# EAGLE design alimentadorV6 (EAGLE 6.6.0)
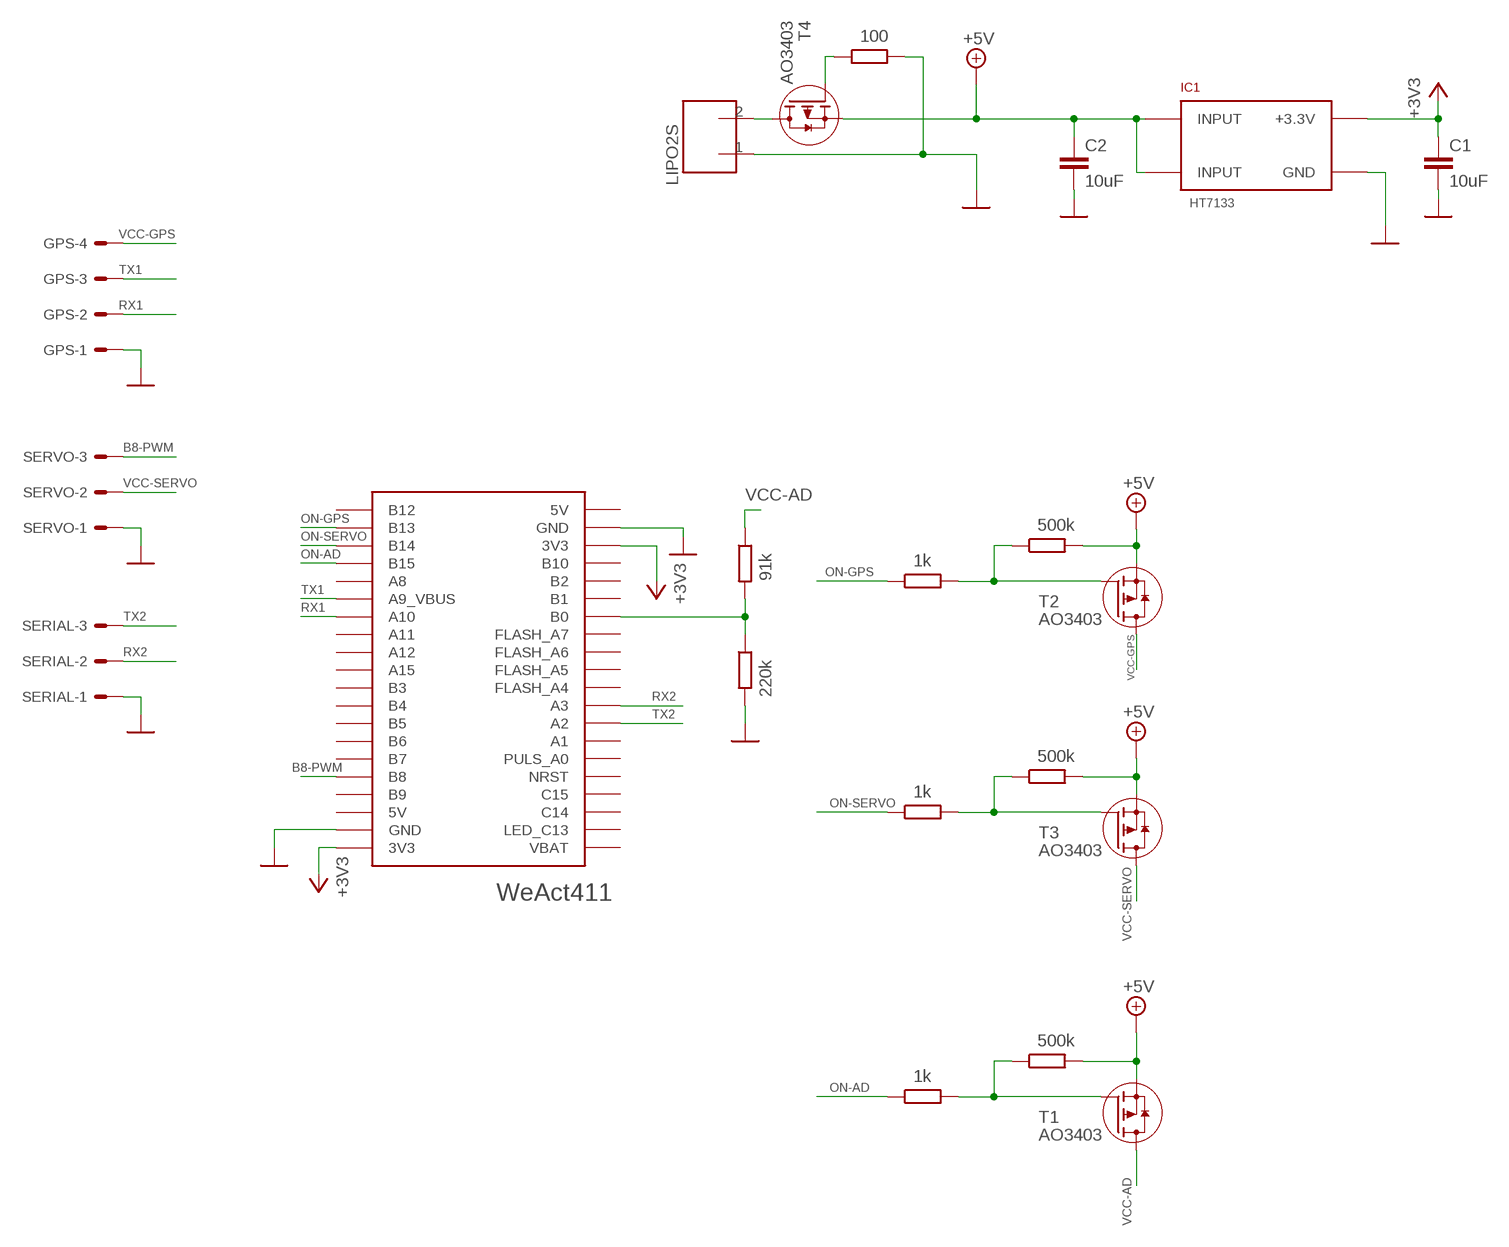
[diagram p0: schematic, sheet 1]

## Parts
C1  10uF  C-EUC1206  [C1206]
C2  10uF  C-EUC1206  [C1206]
GPS  22-27-2041-04  [6410-04]
IC1  HT7133  [SOT89]
LIPO2S  CONECTOR_2P-3.81  [CON2P-3.81]
R1  500k  R-EU_R1206  [R1206]
R2  220k  R-EU_R1206  [R1206]
R3  91k  R-EU_R1206  [R1206]
R4  1k  R-EU_R1206  [R1206]
R5  500k  R-EU_R1206  [R1206]
R6  1k  R-EU_R1206  [R1206]
R7  100  R-EU_R1206  [R1206]
R11  500k  R-EU_R1206  [R1206]
R12  1k  R-EU_R1206  [R1206]
SERIAL  22-27-2031-03  [6410-03]
SERVO  22-27-2031-03  [6410-03]
T1  AO3403  [SOT23]
T2  AO3403  [SOT23]
T3  AO3403  [SOT23]
T4  AO3403  [SOT23]
U$2  WEACT411  [WEACT411]

## Nets
+3V3: C1.1 IC1.3(+3.3V) U$2.3V3@1(3V3) U$2.3V3@2(3V3)
+5V: C2.1 IC1.2(INPUT) IC1.4(INPUT) R1.2 R5.2 R11.2 T1.2(S) T2.2(S) T3.2(S) T4.2(S)
B8-PWM: SERVO.3 U$2.B8
GND [pwr]: C1.2 C2.2 GPS.1 IC1.1(GND) LIPO2S.1 R2.2 R7.2 SERIAL.1 SERVO.1 U$2.GND@1(GND) U$2.GND@2(GND)
N$1: LIPO2S.2 T4.3(D)
N$2: R2.1 R3.2 U$2.B0
N$3: R7.1 T4.1(G)
N$5: R1.1 R4.2 T2.1(G)
N$6: R11.1 R12.2 T1.1(G)
N$8: R5.1 R6.2 T3.1(G)
ON-AD: R12.1 U$2.B15
ON-GPS: R4.1 U$2.B13
ON-SERVO: R6.1 U$2.B14
RX1: GPS.2 U$2.A10
RX2: SERIAL.2 U$2.A3
TX1: GPS.3 U$2.A9(A9_VBUS)
TX2: SERIAL.3 U$2.A2
VCC-AD: R3.1 T1.3(D)
VCC-GPS: GPS.4 T2.3(D)
VCC-SERVO: SERVO.2 T3.3(D)
Unconnected: U$2.5V@1(5V) U$2.5V@2(5V) U$2.A0(PULS_A0) U$2.A1 U$2.A4(FLASH_A4) U$2.A5(FLASH_A5) U$2.A6(FLASH_A6) U$2.A7(FLASH_A7) U$2.A8 U$2.A11 U$2.A12 U$2.A15 U$2.B1 U$2.B2 U$2.B3 U$2.B4 U$2.B5 U$2.B6 U$2.B7 U$2.B9 U$2.B10 U$2.B12 U$2.C13(LED_C13) U$2.C14 U$2.C15 U$2.NRST U$2.VBAT

## Library data of the parts
C1 C2 = rcl:C-EU: CAPACITOR, European symbol
GPS = con-molex:22-?-04: CONNECTOR wire to board 2.54 mm (.1 inch) pitch header; OC_FARNELL: unknown; OC_NEWARK: unknown
IC1 = jcf:HT7133: HT73333 Regulador LDO 3.3V Vinput max. 12V Iquiescent 4uA Imax 250mA
LIPO2S = jcf:CONECTOR_2P-3.81
R1-R7 R11 R12 = rcl:R-EU_: RESISTOR, European symbol
SERIAL SERVO = con-molex:22-?-03: CONNECTOR wire to board 2.54 mm (.1 inch) pitch header; OC_FARNELL: unknown; OC_NEWARK: unknown
T1-T4 = jcf:AO3403: AO3403 P-channel MOSFET 2.6A 30V
U$2 = jcf:WEACT411: WeAct STM32F411

## Net classes
0 default: width 0.241 mm, drill 0.584 mm, clearance 0.241 mm
1 pwr: width 0.25 mm

## Board
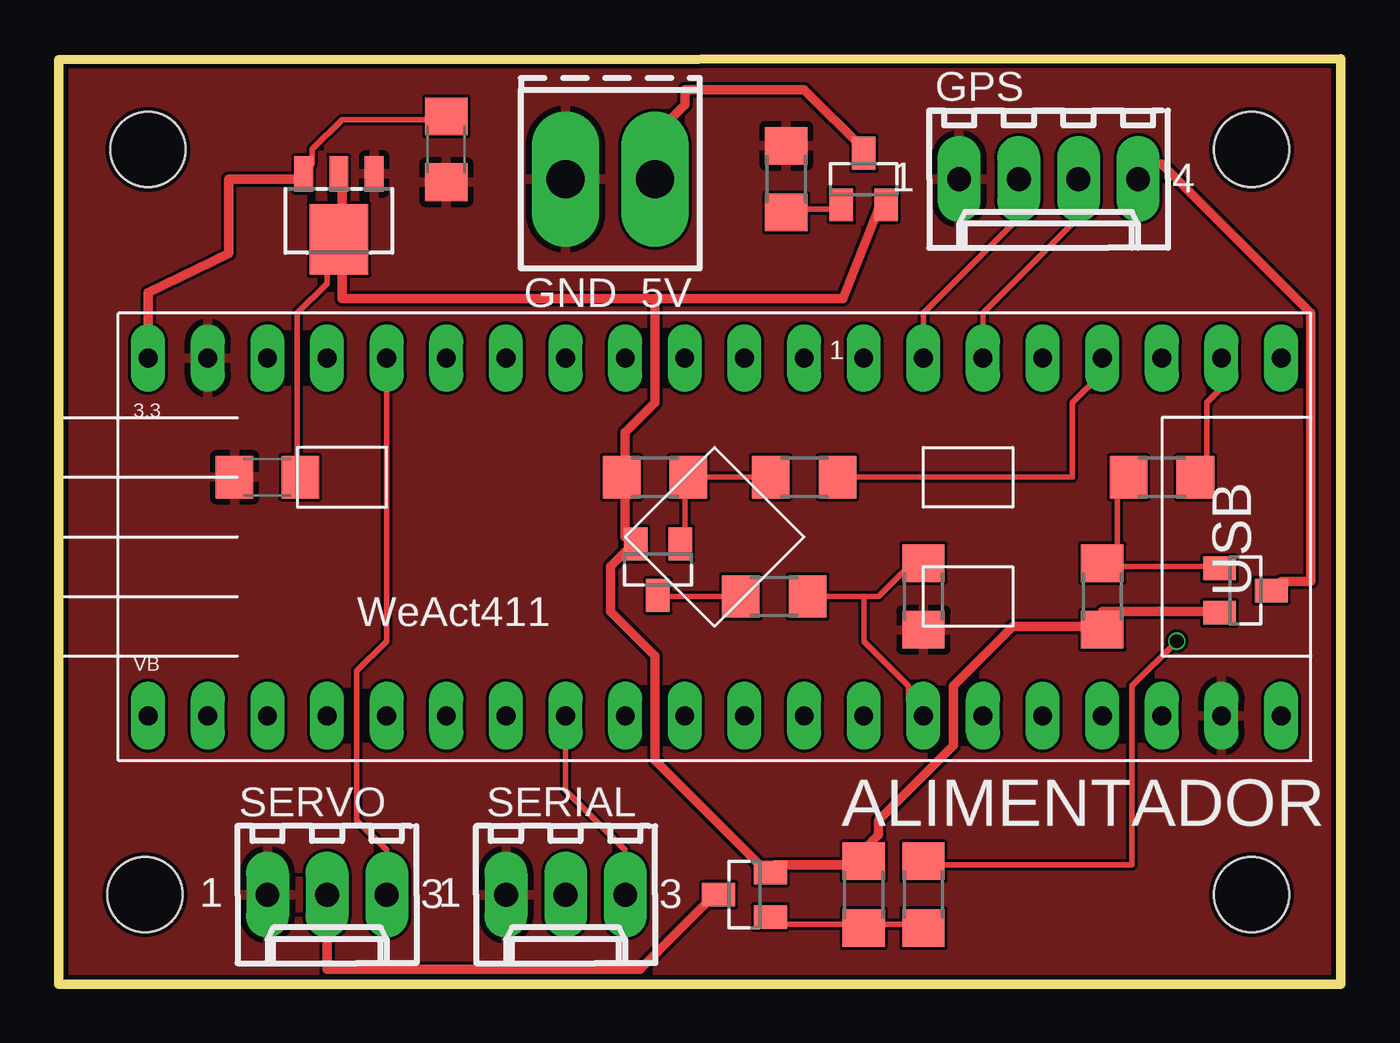
[diagram p1: board, top side]
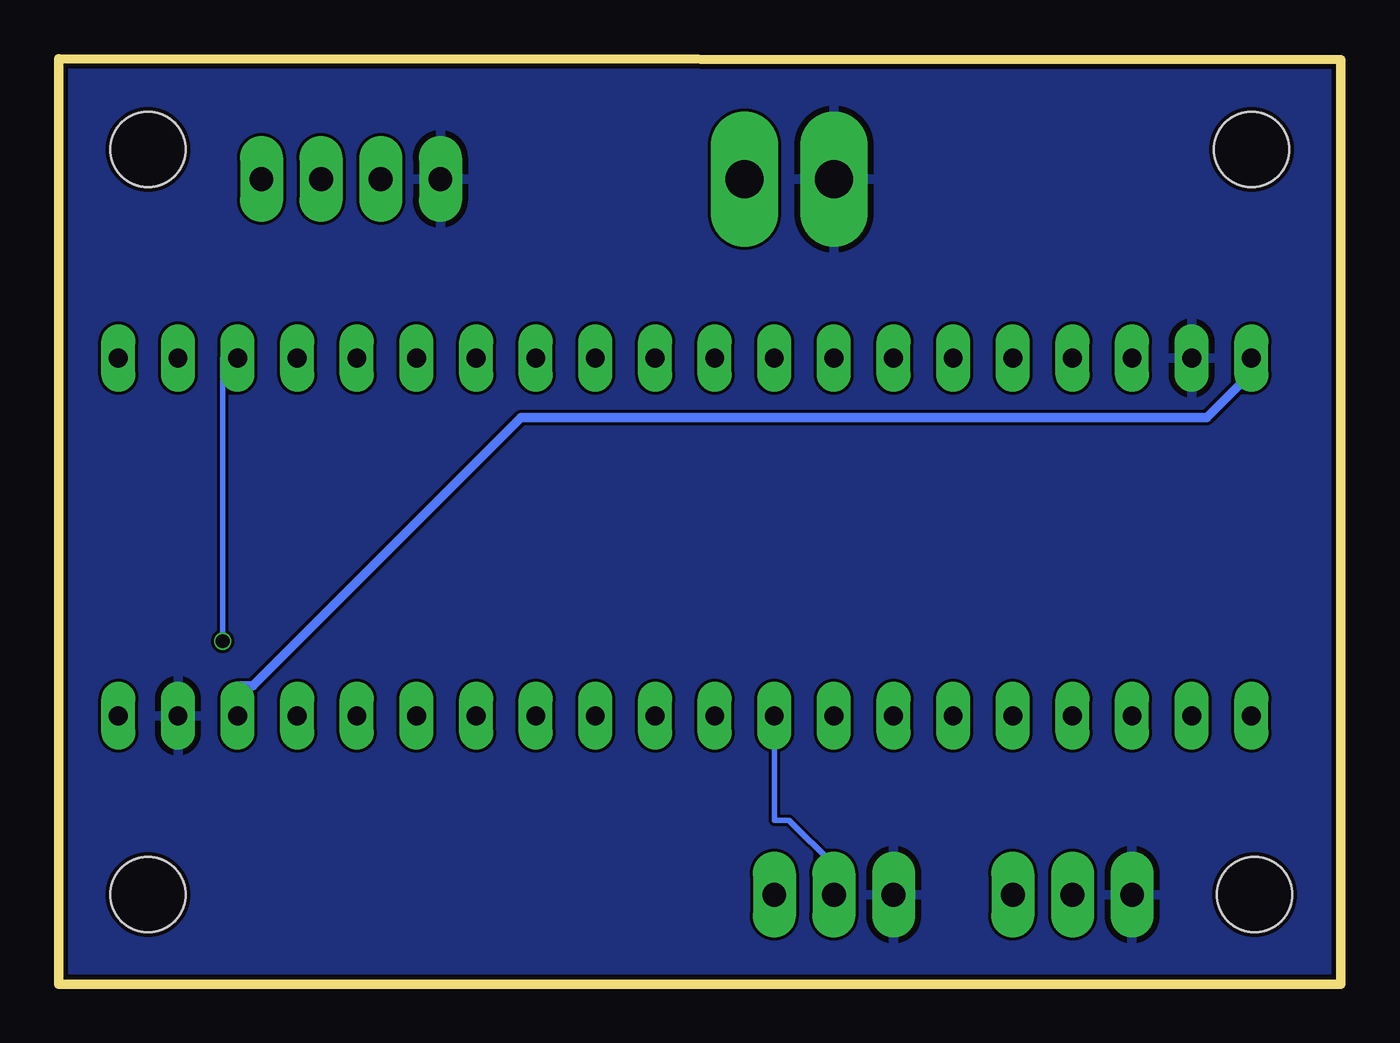
[diagram p2: board, bottom side, seen from below]

Size 54.61 x 39.42 mm. Coordinates in mm from the lower left corner, seen from the top.
Outline: 0,39.37 0,0 54.61,0 54.61,39.42 0,39.37
Copper layers (1*16): Top 0.035mm / dielectric 1.6mm / Bottom 0.035mm
Design rules "jlcpcb-2layers": minimum track width 5mil, minimum drill 0.3mm, track to track 5mil, track to pad 5mil, pad to pad 5mil, via to via 5mil, smd to smd 5mil, copper to edge 0.2mm, drill to drill 6mil, minimum pad ring 10mil, minimum via ring 3mil, stop-mask expansion 4mil, vias tented up to drill 0mil, thermal gap 10mil
Holes 3.2 mm at 50.8,3.81 3.68,3.81 50.8,35.56 3.81,35.56

### Footprints (pad centres in the part's own frame; a part is rotated, then mirrored left to right if it is on the bottom)
C1206 = smd 1.6 x 1.8: 1 -1.4,0; 2 1.4,0
6410-04 = drill 1.016 long: 1 3.81,0; 2 1.27,0; 3 -1.27,0; 4 -3.81,0
SOT89 = smd 0.8 x 1.5: 1 -1.5,-1.75; 2 0,-1.75; 3 1.5,-1.75 | smd 2.5 x 3: 4 0,1.05
CON2P-3.81 = drill 1.6 long: 1 0,0; 2 3.81,0
R1206 = smd 1.6 x 1.803: 1 -1.422,0; 2 1.422,0
6410-03 = drill 1.016 long: 1 2.54,0; 2 0,0; 3 -2.54,0
SOT23 = smd 1 x 1.4: 1 -0.95,-1.1; 2 0.95,-1.1; 3 0,1.1
WEACT411 = drill 0.8 long: 3V3@1 43.18,0; 3V3@2 0,15.24; 5V@1 48.26,0; 5V@2 5.08,15.24; A0 12.7,0; A1 15.24,0; A2 17.78,0; A3 20.32,0; A4 22.86,0; A5 25.4,0; A6 27.94,0; A7 30.48,0; A8 38.1,15.24; A9 35.56,15.24; A10 33.02,15.24; A11 30.48,15.24; A12 27.94,15.24; A15 25.4,15.24; B0 33.02,0; B1 35.56,0; B2 38.1,0; B3 22.86,15.24; B4 20.32,15.24; B5 17.78,15.24; B6 15.24,15.24; B7 12.7,15.24; B8 10.16,15.24; B9 7.62,15.24; B10 40.64,0; B12 48.26,15.24; B13 45.72,15.24; B14 43.18,15.24; B15 40.64,15.24; C13 2.54,0; C14 5.08,0; C15 7.62,0; GND@1 45.72,0; GND@2 2.54,15.24; NRST 10.16,0; VBAT 0,0

### Placement (x,y rotation side)
C1  16.51,35.56 270 top
C2  8.89,21.59 180 top
GPS  42.16,34.29 180 top
IC1  11.94,32.77 180 top
LIPO2S  21.59,34.29 0 top
R1  44.45,16.51 270 top
R2  36.83,16.51 270 top
R3  30.48,16.51 0 top
R4  46.99,21.59 180 top
R5  34.29,3.81 90 top
R6  36.83,3.81 270 top
R7  30.99,34.29 90 top
R11  25.4,21.59 180 top
R12  31.75,21.59 180 top
SERIAL  21.59,3.81 180 top
SERVO  11.43,3.81 180 top
T1  25.53,17.65 180 top
T2  50.55,16.76 270 top
T3  29.21,3.81 90 top
T4  34.29,34.29 0 top
U$2  3.81,11.43 0 top

### Tracks (layer width: path | path; a pad name or v marks a point on that pad's centre or on a via)
+3V3
  Top 0.241: C1.1 16.51,36.83 12.06,36.83 10.79,35.56 10.79,34.92 IC1.3 10.16,34.29
  Top 0.406: 10.16,34.29 7.24,34.29 7.24,31.11 3.81,29.46 U$2.3V3@2
  Bottom 0.406: U$2.3V3@1 46.99,12.7 46.36,12.7 34.93,24.13 5.71,24.13 3.81,26.04 U$2.3V3@2
+5V
  Top 0.241: 30.48,5.08 T3.2 29.84,5.08 | 34.29,5.08 R5.2 34.29,5.71 | 44.45,15.87 44.45,15.24 R1.2 | 48.9,15.87 T2.2 | 34.93,33.02 T4.2 | 12.06,31.11 IC1.4 | 12.06,34.29 IC1.2 | 12.06,31.75 IC1.4 | C2.1 10.16,21.59 10.16,28.57 11.43,29.85 11.43,31.11 IC1.4 | 24.13,21.59 R11.2 | 24.13,18.42 T1.2
  Top 0.406: 34.29,5.08 30.48,5.08 | 44.45,15.87 48.9,15.87 | 34.29,5.71 34.93,6.35 34.93,6.98 38.1,10.16 38.1,12.7 40.64,15.24 44.45,15.24 | T1.2 24.13,19.05 24.13,21.59 24.13,23.5 25.4,24.77 25.4,29.21 | 34.93,33.02 33.4,29.21 25.4,29.21 | 25.4,29.21 12.06,29.21 12.06,31.11 | 12.06,31.75 12.06,34.29 | 29.84,5.08 25.4,9.53 25.4,13.97 23.5,15.87 23.5,17.78 24.13,18.42
B8-PWM
  Top 0.241: U$2.B8 13.97,14.6 12.7,13.33 12.7,6.98 13.97,5.71 SERVO.3
GND
  pour Bottom: 0,0 54.61,0 54.61,39.37 0,39.37
  pour Top: 0,39.37 54.61,39.37 54.61,0 0,0
N$1
  Top 0.241: 34.29,35.56 T4.3
  Top 0.406: 34.29,35.56 31.75,38.1 26.67,38.1 26.67,37.46 25.4,36.2 LIPO2S.2
N$2
  Top 0.241: 34.29,16.51 34.93,16.51 36.83,18.42 R2.1 | 34.29,16.51 R3.2 | U$2.B0 36.2,12.06 36.2,12.7 34.29,14.6 34.29,16.51
N$3
  Top 0.241: T4.1 33.02,33.02 31.11,33.02 R7.1
N$5
  Top 0.241: 45.09,17.78 44.45,17.78 R1.1 45.09,17.78 | 45.09,17.78 48.9,17.78 T2.1 | 45.09,17.78 45.09,21.59 R4.2
N$6
  Top 0.241: T1.1 26.67,19.05 26.67,21.59 R11.1 R12.2
N$8
  Top 0.241: 34.29,2.54 30.48,2.54 T3.1 | 34.29,2.54 36.83,2.54 R6.2 | 34.29,2.54 R5.1
ON-AD
  Top 0.241: R12.1 43.18,21.59 43.18,24.77 44.45,26.04 U$2.B15
ON-GPS
  Top 0.241: U$2.B13 49.53,25.4 48.9,24.77 48.9,21.59 R4.1
ON-SERVO  (via drill 0.58)
  Top 0.241: v47.62,14.6 45.72,12.7 45.72,5.08 36.83,5.08 R6.1
  Bottom 0.241: v47.62,14.6 47.62,26.67 U$2.B14
RX1
  Top 0.241: U$2.A10 36.83,28.57 40.64,32.38 40.64,34.29 GPS.2
RX2
  Bottom 0.241: U$2.A3 24.13,6.98 23.5,6.98 21.59,5.08 SERIAL.2
TX1
  Top 0.241: U$2.A9 39.37,28.57 43.18,32.38 43.18,34.29 GPS.3
TX2
  Top 0.241: U$2.A2 21.59,8.25 24.13,5.71 SERIAL.3
VCC-AD
  Top 0.241: R3.1 25.4,16.51 T1.3
VCC-GPS
  Top 0.241: 52.07,17.14 T2.3
  Top 0.406: 52.07,17.14 53.34,17.14 53.34,28.57 46.99,34.92 46.36,34.92 46.36,34.29 GPS.4
VCC-SERVO
  Top 0.241: 27.94,3.81 T3.3
  Top 0.406: 27.94,3.81 24.77,0.64 11.43,0.64 SERVO.2

### Text on the board
tPlace: GND 5V
tNames: 1 | ALIMENTADOR